# Altium schematic sheet LM5116程控电源.SchDoc
size A4
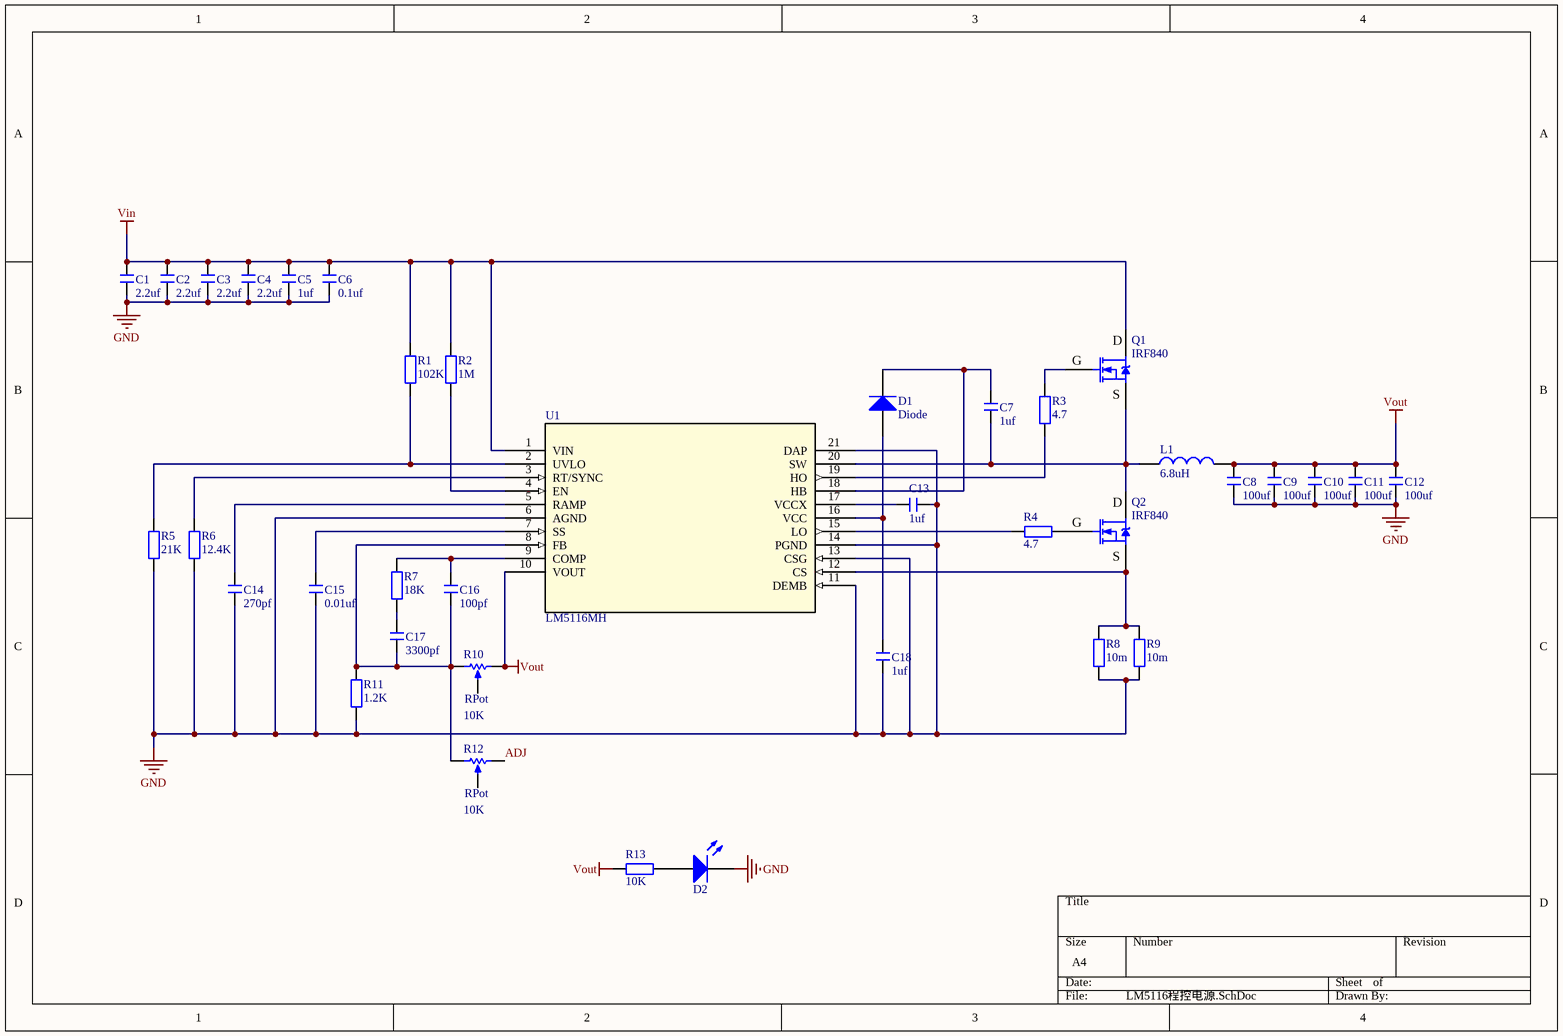
[diagram p0: LM5116程控电源.SchDoc]

## Parts
C1  2.2uf  [C 1812_L]
C2  2.2uf  [C 1812_L]
C3  2.2uf  [C 1812_L]
C4  2.2uf  [C 1812_L]
C5  1uf  [C 1210_L]
C6  0.1uf  [C 0805_L]
C7  1uf  [C 0805_L]
C8  100uf  [C 1812_L]
C9  100uf  [C 1812_L]
C10  100uf  [C 1812_L]
C11  100uf  [C 1812_L]
C12  100uf  [C 1812_L]
C13  1uf  [C 0805_L]
C14  270pf  [C 0603_L]
C15  0.01uf  [C 0603_L]
C16  100pf  [C 0603_L]
C17  3300pf  [C 0603_L]
C18  1uf  [C 0805_L]
D1  Diode  [SOD-323]
D2  LED  [LED 0603G]  (value not drawn)
L1  6.8uH  [IND-SMD_L12.6-W12.6_MS1350-XX]
Q1  IRF840  [SOT669]
Q2  IRF840  [SOT669]
R1  102K  [R 0603_L]
R2  1M  [R 0603_L]
R3  4.7  [R 0603_L]
R4  4.7  [R 0603_L]
R5  21K  [R 0603_L]
R6  12.4K  [R 0603_L]
R7  18K  [R 0603_L]
R8  10m  [R 0805_L]
R9  10m  [R 0805_L]
R10  RPot  value 10K  [RES-ADJ-SMD_3P-L3.8-W3.6-P1.90-BL]
R11  1.2K  [R 0603_L]
R12  RPot  value 10K  [RES-ADJ-SMD_3P-L3.8-W3.6-P1.90-BL]
R13  10K  [R 0603_L]
U1  LM5116MH  [HTSSOP-20_L6.5-W4.4-P0.65-LS6.4-BL-EP]

## Nets
GND: C1.1 C2.1 C3.1 C4.1 C5.1 C6.1 C8.1 C9.1 C10.1 C11.1 C12.1 C13.1 C14.1 C15.1 C18.1 D2.2(K) R5.1 R6.1 R8.1 R9.1 R11.1 U1.6(AGND) U1.11(DEMB) U1.13(CSG) U1.14(PGND) U1.21(DAP)
Vin: C1.2 C2.2 C3.2 C4.2 C5.2 C6.2 Q1.2(D) R1.2 R2.2 U1.1(VIN)
Vout: C8.2 C9.2 C10.2 C11.2 C12.2 L1.2 R10.2(BOT) R13.2 U1.10(VOUT)
ADJ: R12.2(BOT)
NetC7_1: C7.1 L1.1 Q1.3(S) Q2.2(D) U1.20(SW)
NetC7_2: C7.2 D1.2(K) U1.18(HB)
NetC13_2: C13.2 U1.17(VCCX)
NetC14_2: C14.2 U1.5(RAMP)
NetC15_2: C15.2 U1.7(SS)
NetC16_1: C16.1 C17.1 R10.1(TOP) R11.2 R12.1(TOP) U1.8(FB)
NetC16_2: C16.2 R7.2 U1.9(COMP)
NetC17_2: C17.2 R7.1
NetC18_2: C18.2 D1.1(A) U1.16(VCC)
NetD2_1: D2.1(A) R13.1
NetQ1_1: Q1.1(G) R3.2
NetQ2_1: Q2.1(G) R4.1
NetQ2_3: Q2.3(S) R8.2 R9.2 U1.12(CS)
NetR1_1: R1.1 R5.2 U1.2(UVLO)
NetR2_1: R2.1 U1.4(EN)
NetR3_1: R3.1 U1.19(HO)
NetR4_2: R4.2 U1.15(LO)
NetR6_2: R6.2 U1.3(RT/SYNC)

Not connected (* = marked no-connect by the designer): R10 3(TAP); R12 3(TAP)

## Library data of the parts
C1-C18 = C: 贴片电容; BOM名称: 无极性贴片电容; 淘宝ID: 封装库来自淘宝 ID：黄晶宝石; 联系售后，技术支持: https://shop463601444.taobao.com; 唯一出售店铺网址: https://shop463601444.taobao.com
D1 = Diode: Default Diode; Published: 8-Jun-2000; LatestRevisionDate: 17-Jul-2002; LatestRevisionNote: Re-released for DXP Platform.; PackageVersion: Sep-1996; PackageReference: SMC; Publisher: Altium Limited; PackageDescription: DO-214-AB/SMC; 2 C-Bend Leads; Body 7.9 x 5.9 mm, inc. leads (LxW); Code_JEDEC: DO-214-AB
D2 = LED: 发光二极管; 技术支持，联系售后: https://shop463601444.taobao.com
L1 = L: 小功率贴片电感; 淘宝ID: 封装库来自淘宝 ID：黄晶宝石; 封装库来自淘宝卖家 ID：黄晶宝石: 其他店铺购入均为盗版，不享受售后技术支持服务，请立即申请退款; BOM名称: 小功率贴片电感; 联系售后: https://item.taobao.com/item.htm?id=566775463719
Q1 Q2 = IRF840: N沟场效应管; BOM名称: N沟场效应管; 技术支持，联系售后: https://item.taobao.com/item.htm?id=566775463719
R1-R9 R11 R13 = R: 贴片电阻; 版权归属: 来自淘宝 ID：黄晶宝石; 封装库来自淘宝卖家 ID：黄晶宝石: 其他店铺购入均为盗版，不享受售后技术支持服务，请立即申请退款; BOM名称: 贴片电阻; 联系售后: https://item.taobao.com/item.htm?id=566775463719
R10 R12 = RPot: Potentiometer; Sim Note: Enter the Resistance value and the set point into parameter fields.; Set Position: 0.5; Published: 8-Jun-2000; LatestRevisionDate: 17-Jul-2002; LatestRevisionNote: Re-released for DXP Platform.; PackageReference: VR5; Publisher: Altium Limited; PackageDescription: Variable Resistor, Thru-Hole; 3 Leads
U1 = LM5116MH: No Description Available; Mfr_Name: Texas Instruments; Copyright: Copyright (C) 2024 Ultra Librarian. All rights reserved.; Manufacturer_Part_Number: LM5116MH; RefDes: RefDes; Type: DEV